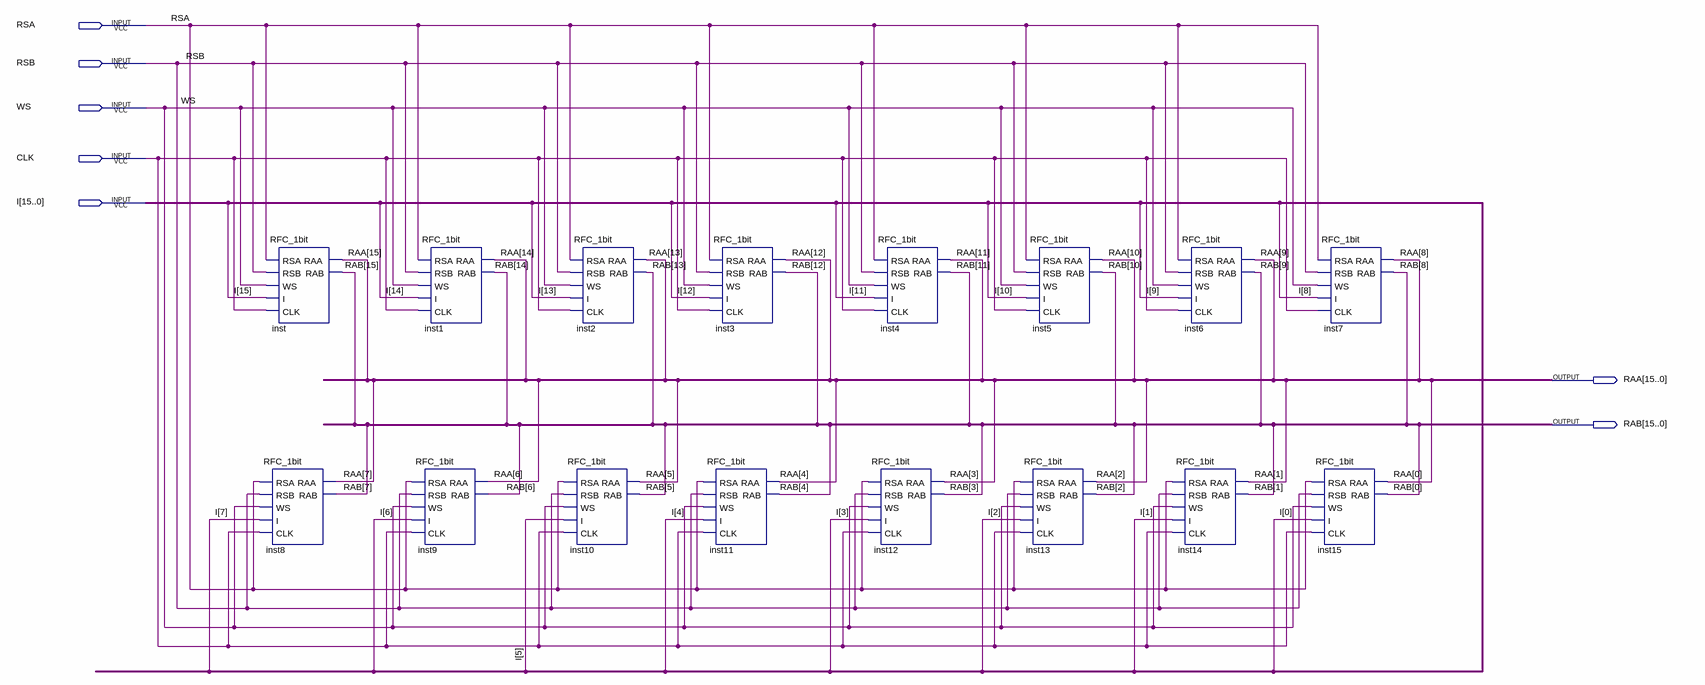
[diagram p0: schematic sheet]
// Quartus schematic RFC_16bit.bdf as structural Verilog: 16 symbols, 7 pins
module RFC_16bit (
  input  RSA,
  input  RSB,
  input  WS,
  input  CLK,
  input  [15:0] I,
  output [15:0] RAA,
  output [15:0] RAB
);

  RFC_1bit inst (.RSA(RSA), .RSB(RSB), .WS(WS), .I(I[15]), .CLK(CLK), .RAA(RAA[15]), .RAB(RAB[15]));
  RFC_1bit inst8 (.RSA(RSA), .RSB(RSB), .WS(WS), .I(I[7]), .CLK(CLK), .RAA(RAA[7]), .RAB(RAB[7]));
  RFC_1bit inst1 (.RSA(RSA), .RSB(RSB), .WS(WS), .I(I[14]), .CLK(CLK), .RAA(RAA[14]), .RAB(RAB[14]));
  RFC_1bit inst9 (.RSA(RSA), .RSB(RSB), .WS(WS), .I(I[6]), .CLK(CLK), .RAA(RAA[6]), .RAB(RAB[6]));
  RFC_1bit inst2 (.RSA(RSA), .RSB(RSB), .WS(WS), .I(I[13]), .CLK(CLK), .RAA(RAA[13]), .RAB(RAB[13]));
  RFC_1bit inst10 (.RSA(RSA), .RSB(RSB), .WS(WS), .I(I[5]), .CLK(CLK), .RAA(RAA[5]), .RAB(RAB[5]));
  RFC_1bit inst3 (.RSA(RSA), .RSB(RSB), .WS(WS), .I(I[12]), .CLK(CLK), .RAA(RAA[12]), .RAB(RAB[12]));
  RFC_1bit inst11 (.RSA(RSA), .RSB(RSB), .WS(WS), .I(I[4]), .CLK(CLK), .RAA(RAA[4]), .RAB(RAB[4]));
  RFC_1bit inst4 (.RSA(RSA), .RSB(RSB), .WS(WS), .I(I[11]), .CLK(CLK), .RAA(RAA[11]), .RAB(RAB[11]));
  RFC_1bit inst12 (.RSA(RSA), .RSB(RSB), .WS(WS), .I(I[3]), .CLK(CLK), .RAA(RAA[3]), .RAB(RAB[3]));
  RFC_1bit inst5 (.RSA(RSA), .RSB(RSB), .WS(WS), .I(I[10]), .CLK(CLK), .RAA(RAA[10]), .RAB(RAB[10]));
  RFC_1bit inst13 (.RSA(RSA), .RSB(RSB), .WS(WS), .I(I[2]), .CLK(CLK), .RAA(RAA[2]), .RAB(RAB[2]));
  RFC_1bit inst6 (.RSA(RSA), .RSB(RSB), .WS(WS), .I(I[9]), .CLK(CLK), .RAA(RAA[9]), .RAB(RAB[9]));
  RFC_1bit inst14 (.RSA(RSA), .RSB(RSB), .WS(WS), .I(I[1]), .CLK(CLK), .RAA(RAA[1]), .RAB(RAB[1]));
  RFC_1bit inst7 (.RSA(RSA), .RSB(RSB), .WS(WS), .I(I[8]), .CLK(CLK), .RAA(RAA[8]), .RAB(RAB[8]));
  RFC_1bit inst15 (.RSA(RSA), .RSB(RSB), .WS(WS), .I(I[0]), .CLK(CLK), .RAA(RAA[0]), .RAB(RAB[0]));
endmodule
